# Altium project VFD_Clock.PrjPcb
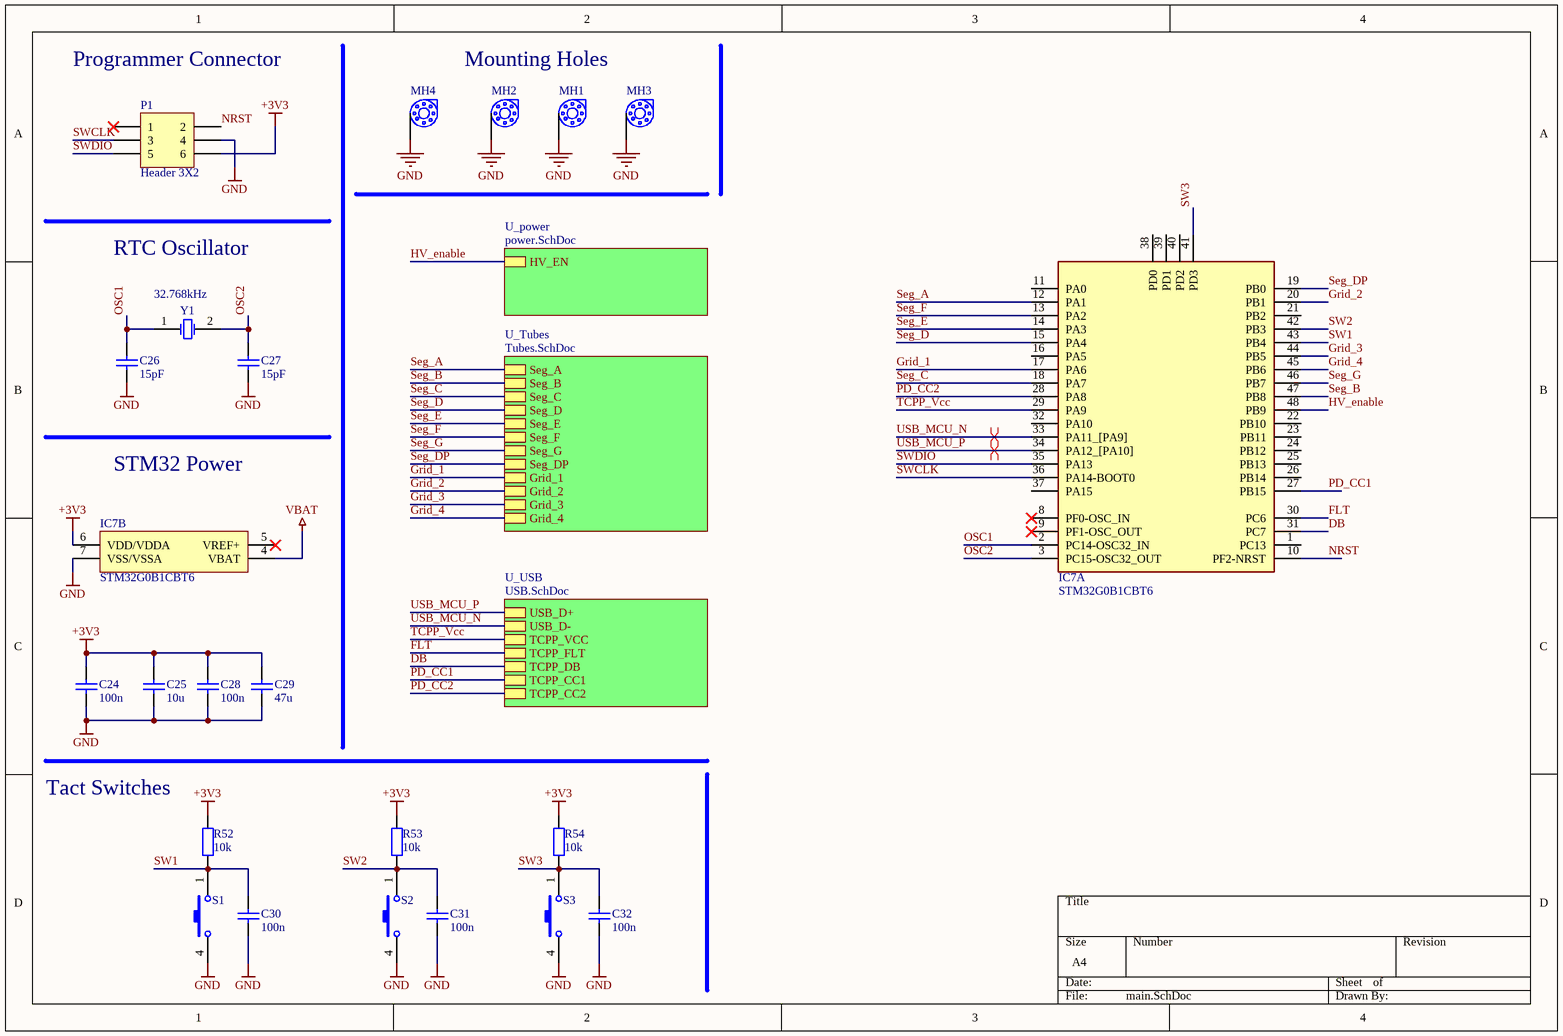
[diagram p0: main.SchDoc]
4 sheets, 138 parts. Net scope: hierarchical (ports join the sheet entries above them; power ports are global).
Board file: ClockPCB.PcbDoc
Sheets:
  main.SchDoc
    U_Tubes = Tubes.SchDoc
    U_power = power.SchDoc
    U_USB = USB.SchDoc

## Sheet main.SchDoc
size A4; SheetNumber: 1; SheetTotal: 4; SPICEModelCacheVDPEFNXI: <root> / <DocumentId>VDPEFNXI</DocumentId> / </root>

### Parts
C24  100n  [1608[0603]]
C25  10u  [1608[0603]]
C26  15pF  [1608[0603]]
C27  15pF  [1608[0603]]
C28  100n  [1608[0603]]
C29  47u  [1608[0603]]
C30  100n  [1608[0603]]
C31  100n  [1608[0603]]
C32  100n  [1608[0603]]
IC7  STM32G0B1CBT6  [QFP50P900X900X160-48N]  (parts A,B of 2)
MH1  HOLE 2mm  [Hole]  (value not drawn)  (no BOM)
MH2  HOLE 2mm  [Hole]  (value not drawn)  (no BOM)
MH3  HOLE 2mm  [Hole]  (value not drawn)  (no BOM)
MH4  HOLE 2mm  [Hole]  (value not drawn)  (no BOM)
P1  Header 3X2  [HDR2X3]
R52  10k  [J1-0603]
R53  10k  [J1-0603]
R54  10k  [J1-0603]
S1  PTS647SK70SMTR2N_LFS  [PTS647SK70SMTR2NLFS]  (value not drawn)
S2  PTS647SK70SMTR2N_LFS  [PTS647SK70SMTR2NLFS]  (value not drawn)
S3  PTS647SK70SMTR2N_LFS  [PTS647SK70SMTR2NLFS]  (value not drawn)
Y1  32.768kHz  [ABS06N32768kHzT]

### Sub-sheets
U_power = power.SchDoc: HV_EN
U_Tubes = Tubes.SchDoc: Seg_A, Seg_B, Seg_C, Seg_D, Seg_E, Seg_F, Seg_G, Seg_DP, Grid_1, Grid_2, Grid_3, Grid_4
U_USB = USB.SchDoc: TCPP_VCC, TCPP_FLT, TCPP_DB, TCPP_CC1, TCPP_CC2, USB_D+, USB_D-

### Nets
+3V3: C24.2 C25.2 C28.2 C29.2 IC7.6(VDD/VDDA) P1.6 R52.2 R53.2 R54.2
GND: C24.1 C25.1 C26.1 C27.1 C28.1 C29.1 C30.1 C31.1 C32.1 IC7.7(VSS/VSSA) MH1.0(GND) MH2.0(GND) MH3.0(GND) MH4.0(GND) P1.4 S1.4(COM_2) S2.4(COM_2) S3.4(COM_2)
VBAT: IC7.4(VBAT)
DB: IC7.31(PC7) ; sheet U_USB/TCPP_DB
FLT: IC7.30(PC6) ; sheet U_USB/TCPP_FLT
Grid_1: IC7.17(PA6) ; sheet U_Tubes/Grid_1
Grid_2: IC7.20(PB1) ; sheet U_Tubes/Grid_2
Grid_3: IC7.44(PB5) ; sheet U_Tubes/Grid_3
Grid_4: IC7.45(PB6) ; sheet U_Tubes/Grid_4
HV_enable: IC7.48(PB9) ; sheet U_power/HV_EN
NRST: IC7.10(PF2-NRST) P1.2
OSC1: C26.2 IC7.2(PC14-OSC32_IN) Y1.1
OSC2: C27.2 IC7.3(PC15-OSC32_OUT) Y1.2
PD_CC1: IC7.27(PB15) ; sheet U_USB/TCPP_CC1
PD_CC2: IC7.28(PA8) ; sheet U_USB/TCPP_CC2
Seg_A: IC7.12(PA1) ; sheet U_Tubes/Seg_A
Seg_B: IC7.47(PB8) ; sheet U_Tubes/Seg_B
Seg_C: IC7.18(PA7) ; sheet U_Tubes/Seg_C
Seg_D: IC7.15(PA4) ; sheet U_Tubes/Seg_D
Seg_DP: IC7.19(PB0) ; sheet U_Tubes/Seg_DP
Seg_E: IC7.14(PA3) ; sheet U_Tubes/Seg_E
Seg_F: IC7.13(PA2) ; sheet U_Tubes/Seg_F
Seg_G: IC7.46(PB7) ; sheet U_Tubes/Seg_G
SW1: C30.2 IC7.43(PB4) R52.1 S1.1(NO_1)
SW2: C31.2 IC7.42(PB3) R53.1 S2.1(NO_1)
SW3: C32.2 IC7.41(PD3) R54.1 S3.1(NO_1)
SWCLK: IC7.36(PA14-BOOT0) P1.3
SWDIO: IC7.35(PA13) P1.5
TCPP_Vcc: IC7.29(PA9) ; sheet U_USB/TCPP_VCC
USB_MCU_N: IC7.33(PA11_[PA9]) ; sheet U_USB/USB_D-
USB_MCU_P: IC7.34(PA12_[PA10]) ; sheet U_USB/USB_D+

Not connected (* = marked no-connect by the designer): IC7 1(PC13) 5(VREF+)* 8(PF0-OSC_IN)* 9(PF1-OSC_OUT)* 11(PA0) 16(PA5) 21(PB2) 22(PB10) 23(PB11) 24(PB12) 25(PB13) 26(PB14) 32(PA10) 37(PA15) 38(PD0) 39(PD1) 40(PD2); P1 1*

### Layout directives
differential pair: USB_MCU_N, USB_MCU_P

### Notes on the sheet
- Programmer Connector
- Mounting Holes
- RTC Oscillator
- STM32 Power
- (near R52) Tact Switches

### Library data of the parts
C24-C32 = Cap: Capacitor; Value: 100pF; Published: 8-Jun-2000; LatestRevisionDate: 17-Jul-2002; LatestRevisionNote: Re-released for DXP Platform.; PackageReference: RAD-0.3; Publisher: Altium Limited; PackageDescription: Radial Cap, Thru-Hole; 2 Leads; 0.3 in Pin Spacing
IC7 = STM32G0B1CBT6: Integrated Circuit; Manufacturer_Name: STMicroelectronics; Datasheet Link: https://www.st.com/resource/en/datasheet/stm32g0b1cb.pdf; Height: 1.6mm; Manufacturer_Part_Number: STM32G0B1CBT6; Mouser Part Number: 511-STM32G0B1CBT6; Mouser Price/Stock: https://www.mouser.co.uk/ProductDetail/STMicroelectronics/STM32G0B1CBT6?qs=CiayqK2gdcKaQJ%2FcS3grXw%3D%3D; Arrow Part Number: STM32G0B1CBT6; Arrow Price/Stock: https://www.arrow.com/en/products/stm32g0b1cbt6/stmicroelectronics?utm_currency=USD&region=nac
MH1-MH4 = MOUNT_HOLE_2MM_CORNER
P1 = Header 3X2: Header, 3-Pin, Dual row; LatestRevisionDate: 17-Jul-2002; LatestRevisionNote: Re-released for DXP Platform.; Publisher: Altium Limited
R52-R54 = Res2: Resistor; Value: 1K; Published: 8-Jun-2000; LatestRevisionDate: 17-Jul-2002; LatestRevisionNote: Re-released for DXP Platform.; PackageReference: AXIAL-0.4; Publisher: Altium Limited; PackageDescription: Axial Device, Thru-Hole; 2 Leads; 0.4 in Pin Spacing
S1-S3 = PTS647SK70SMTR2N_LFS: Switch (4-Pin Push); Manufacturer_Name: C & K COMPONENTS; Manufacturer_Part_Number: PTS647SK70SMTR2N LFS; Datasheet Link: https://www.ckswitches.com/media/2567/pts647.pdf; Height: 7mm
Y1 = ABS06N-32.768kHz-T: Crystal or Oscillator; Manufacturer_Name: ABRACON; Datasheet Link: https://abracon.com/datasheets/ABS06N.pdf; Height: 0.6mm; Manufacturer_Part_Number: ABS06N-32.768kHz-T

## Sheet Tubes.SchDoc
size A4; SheetNumber: 2; SheetTotal: 4
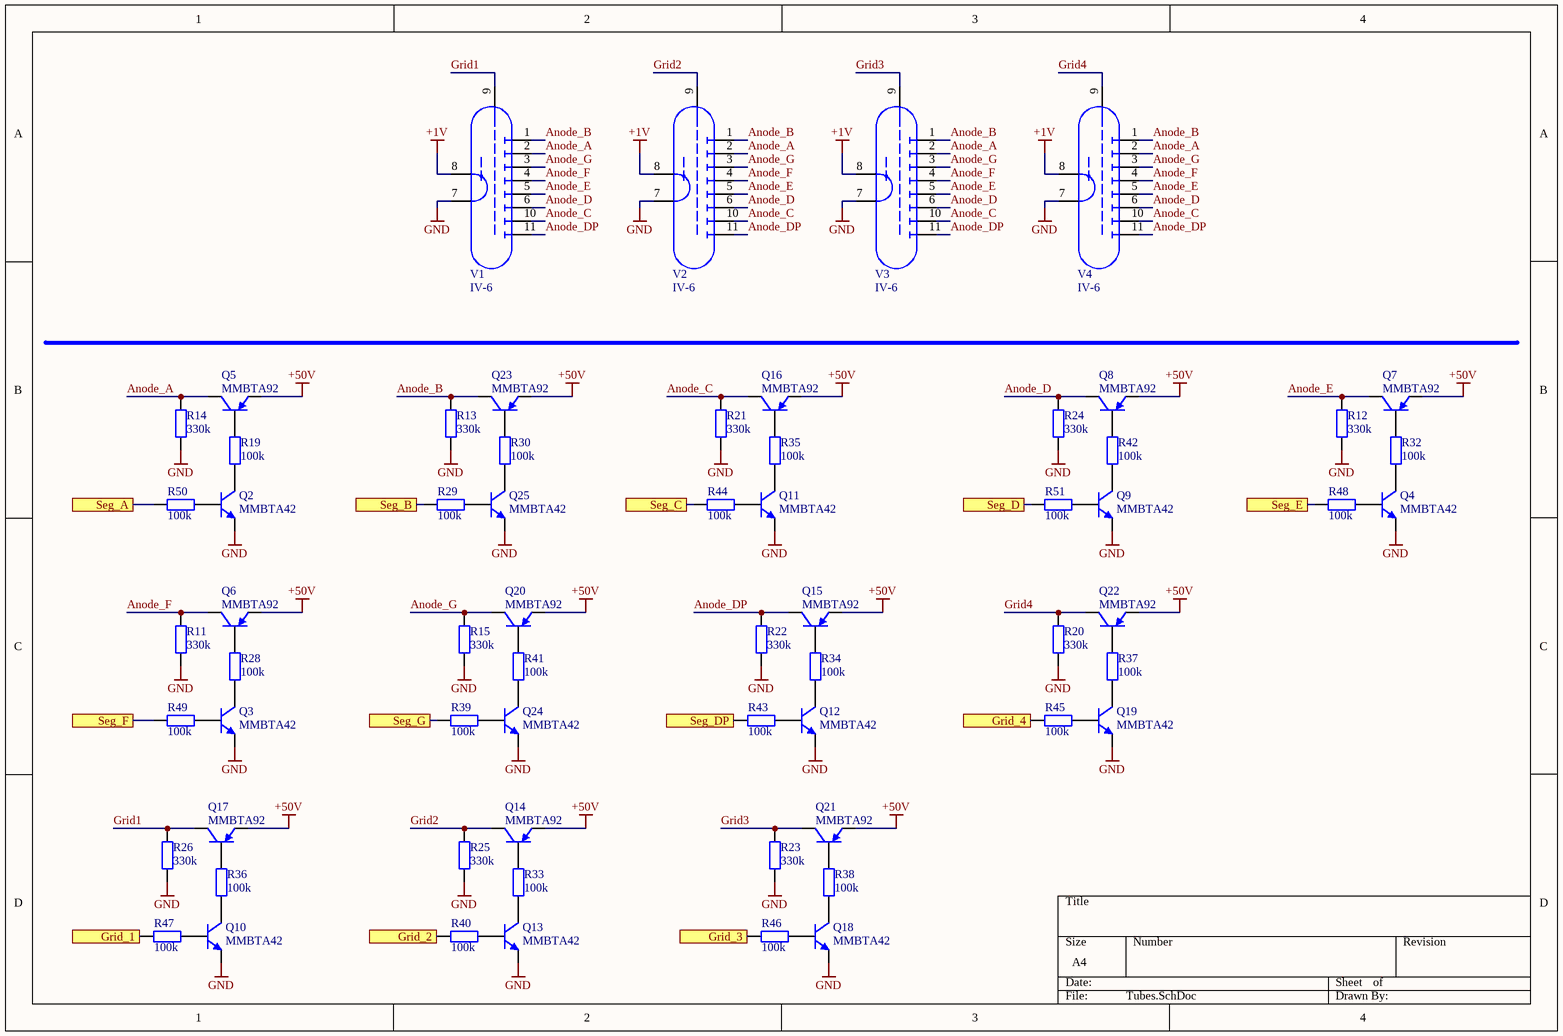
[diagram p1: Tubes.SchDoc]

### Parts
Q2  MMBTA42  [SOT-23_N]
Q3  MMBTA42  [SOT-23_N]
Q4  MMBTA42  [SOT-23_N]
Q5  MMBTA92  [SOT-23B_N]
Q6  MMBTA92  [SOT-23B_N]
Q7  MMBTA92  [SOT-23B_N]
Q8  MMBTA92  [SOT-23B_N]
Q9  MMBTA42  [SOT-23_N]
Q10  MMBTA42  [SOT-23_N]
Q11  MMBTA42  [SOT-23_N]
Q12  MMBTA42  [SOT-23_N]
Q13  MMBTA42  [SOT-23_N]
Q14  MMBTA92  [SOT-23B_N]
Q15  MMBTA92  [SOT-23B_N]
Q16  MMBTA92  [SOT-23B_N]
Q17  MMBTA92  [SOT-23B_N]
Q18  MMBTA42  [SOT-23_N]
Q19  MMBTA42  [SOT-23_N]
Q20  MMBTA92  [SOT-23B_N]
Q21  MMBTA92  [SOT-23B_N]
Q22  MMBTA92  [SOT-23B_N]
Q23  MMBTA92  [SOT-23B_N]
Q24  MMBTA42  [SOT-23_N]
Q25  MMBTA42  [SOT-23_N]
R11  330k  [RES 0805_2012]
R12  330k  [RES 0805_2012]
R13  330k  [RES 0805_2012]
R14  330k  [RES 0805_2012]
R15  330k  [RES 0805_2012]
R19  100k  [J1-0603]
R20  330k  [RES 0805_2012]
R21  330k  [RES 0805_2012]
R22  330k  [RES 0805_2012]
R23  330k  [RES 0805_2012]
R24  330k  [RES 0805_2012]
R25  330k  [RES 0805_2012]
R26  330k  [RES 0805_2012]
R28  100k  [J1-0603]
R29  100k  [J1-0603]
R30  100k  [J1-0603]
R32  100k  [J1-0603]
R33  100k  [J1-0603]
R34  100k  [J1-0603]
R35  100k  [J1-0603]
R36  100k  [J1-0603]
R37  100k  [J1-0603]
R38  100k  [J1-0603]
R39  100k  [J1-0603]
R40  100k  [J1-0603]
R41  100k  [J1-0603]
R42  100k  [J1-0603]
R43  100k  [J1-0603]
R44  100k  [J1-0603]
R45  100k  [J1-0603]
R46  100k  [J1-0603]
R47  100k  [J1-0603]
R48  100k  [J1-0603]
R49  100k  [J1-0603]
R50  100k  [J1-0603]
R51  100k  [J1-0603]
V1  IV-6  [IV-6]
V2  IV-6  [IV-6]
V3  IV-6  [IV-6]
V4  IV-6  [IV-6]

### Ports
Grid_1 (see main[2C]), Grid_2 (see main[2C]), Grid_3 (see main[2C]), Grid_4 (see main[2C]), Seg_A (see main[2B]), Seg_B (see main[2B]), Seg_C (see main[2B]), Seg_D (see main[2C]), Seg_DP (see main[2C]), Seg_E (see main[2C]), Seg_F (see main[2C]), Seg_G (see main[2C])

### Nets
+1V: V1.8 V2.8 V3.8 V4.8
+50V: Q5.3(E) Q6.3(E) Q7.3(E) Q8.3(E) Q14.3(E) Q15.3(E) Q16.3(E) Q17.3(E) Q20.3(E) Q21.3(E) Q22.3(E) Q23.3(E)
GND: Q2.3(E) Q3.3(E) Q4.3(E) Q9.3(E) Q10.3(E) Q11.3(E) Q12.3(E) Q13.3(E) Q18.3(E) Q19.3(E) Q24.3(E) Q25.3(E) R11.1 R12.1 R13.1 R14.1 R15.1 R20.1 R21.1 R22.1 R23.1 R24.1 R25.1 R26.1 V1.7 V2.7 V3.7 V4.7
Anode_A: Q5.1(C) R14.2 V1.2 V2.2 V3.2 V4.2
Anode_B: Q23.1(C) R13.2 V1.1 V2.1 V3.1 V4.1
Anode_C: Q16.1(C) R21.2 V1.10 V2.10 V3.10 V4.10
Anode_D: Q8.1(C) R24.2 V1.6 V2.6 V3.6 V4.6
Anode_DP: Q15.1(C) R22.2 V1.11 V2.11 V3.11 V4.11
Anode_E: Q7.1(C) R12.2 V1.5 V2.5 V3.5 V4.5
Anode_F: Q6.1(C) R11.2 V1.4 V2.4 V3.4 V4.4
Anode_G: Q20.1(C) R15.2 V1.3 V2.3 V3.3 V4.3
Grid1: Q17.1(C) R26.2 V1.9
Grid2: Q14.1(C) R25.2 V2.9
Grid3: Q21.1(C) R23.2 V3.9
Grid4: Q22.1(C) R20.2 V4.9
Grid_1: R47.1 ; port Grid_1
Grid_2: R40.1 ; port Grid_2
Grid_3: R46.1 ; port Grid_3
Grid_4: R45.1 ; port Grid_4
Seg_A: R50.1 ; port Seg_A
Seg_B: R29.1 ; port Seg_B
Seg_C: R44.1 ; port Seg_C
Seg_D: R51.1 ; port Seg_D
Seg_DP: R43.1 ; port Seg_DP
Seg_E: R48.1 ; port Seg_E
Seg_F: R49.1 ; port Seg_F
Seg_G: R39.1 ; port Seg_G
NetQ2_1: Q2.1(C) R19.1
NetQ2_2: Q2.2(B) R50.2
NetQ3_1: Q3.1(C) R28.1
NetQ3_2: Q3.2(B) R49.2
NetQ4_1: Q4.1(C) R32.1
NetQ4_2: Q4.2(B) R48.2
NetQ5_2: Q5.2(B) R19.2
NetQ6_2: Q6.2(B) R28.2
NetQ7_2: Q7.2(B) R32.2
NetQ8_2: Q8.2(B) R42.2
NetQ9_1: Q9.1(C) R42.1
NetQ9_2: Q9.2(B) R51.2
NetQ10_1: Q10.1(C) R36.1
NetQ10_2: Q10.2(B) R47.2
NetQ11_1: Q11.1(C) R35.1
NetQ11_2: Q11.2(B) R44.2
NetQ12_1: Q12.1(C) R34.1
NetQ12_2: Q12.2(B) R43.2
NetQ13_1: Q13.1(C) R33.1
NetQ13_2: Q13.2(B) R40.2
NetQ14_2: Q14.2(B) R33.2
NetQ15_2: Q15.2(B) R34.2
NetQ16_2: Q16.2(B) R35.2
NetQ17_2: Q17.2(B) R36.2
NetQ18_1: Q18.1(C) R38.1
NetQ18_2: Q18.2(B) R46.2
NetQ19_1: Q19.1(C) R37.1
NetQ19_2: Q19.2(B) R45.2
NetQ20_2: Q20.2(B) R41.2
NetQ21_2: Q21.2(B) R38.2
NetQ22_2: Q22.2(B) R37.2
NetQ23_2: Q23.2(B) R30.2
NetQ24_1: Q24.1(C) R41.1
NetQ24_2: Q24.2(B) R39.2
NetQ25_1: Q25.1(C) R30.1
NetQ25_2: Q25.2(B) R29.2

### Library data of the parts
Q2-Q4 Q9-Q13 Q18 Q19 Q24 Q25 = NPN: NPN Bipolar Transistor; Published: 8-Jun-2000; LatestRevisionDate: 17-Jul-2002; LatestRevisionNote: Re-released for DXP Platform.; PackageReference: TO-226-AA; Publisher: Altium Limited; PackageDescription: TO, Flat Index; 3 In-Line, Axial Leads; Body Dia. 4.8mm; Leads 0.55 x 0.51 mm (max); Code_JEDEC: TO-226-AA
Q5-Q8 Q14-Q17 Q20-Q23 = PNP: PNP Bipolar Transistor; Published: 8-Jun-2000; LatestRevisionDate: 29-May-2009; LatestRevisionNote: IPC-7351 Footprint Added.; PackageVersion: Aug-1999; PackageReference: SOT-23B; Publisher: Altium Limited; PackageDescription: 3-Pin SOT-23 Package 0.95 mm Pitch, 2.4 mm Lead Span
R11-R15 R19-R26 R28-R30 R32-R51 = Res2: Resistor; Value: 1K; Published: 8-Jun-2000; LatestRevisionDate: 17-Jul-2002; LatestRevisionNote: Re-released for DXP Platform.; PackageReference: AXIAL-0.4; Publisher: Altium Limited; PackageDescription: Axial Device, Thru-Hole; 2 Leads; 0.4 in Pin Spacing

## Sheet power.SchDoc
size A4; SheetNumber: 3; SheetTotal: 4; SPICEModelCacheCMTQJRSB: <root> / <DocumentId>CMTQJRSB</DocumentId> / </root>
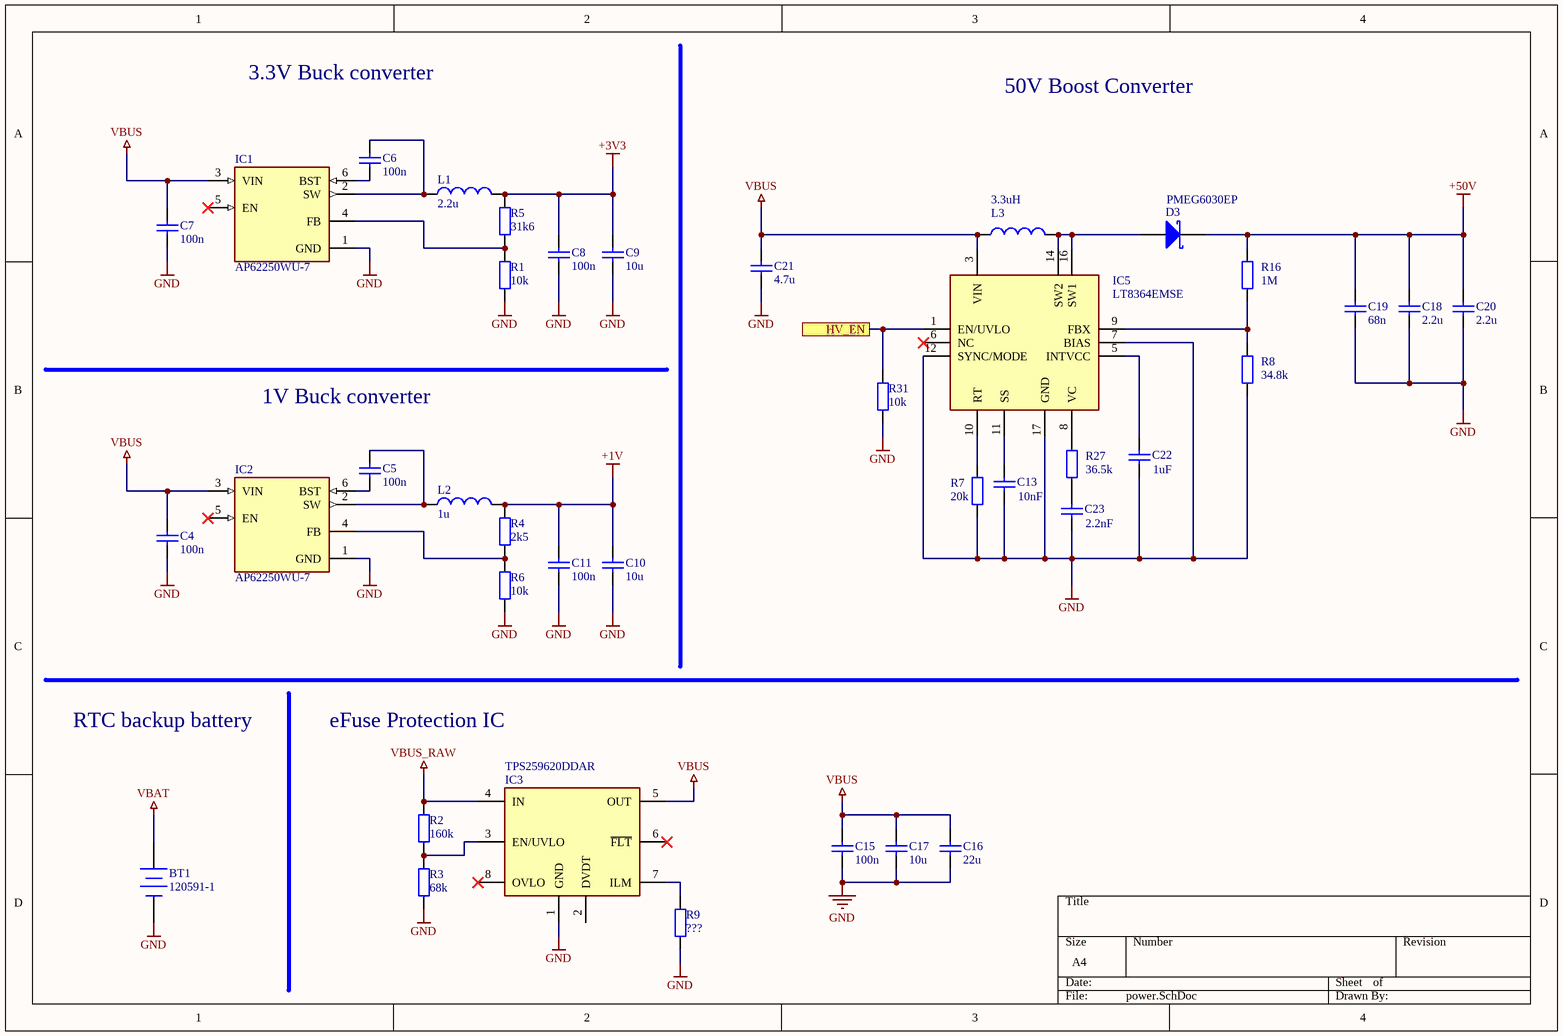
[diagram p2: power.SchDoc]

### Parts
BT1  120591-1  [BR1220_Horizontal]
C4  100n  [1608[0603]]
C5  100n  [1608[0603]]
C6  100n  [1608[0603]]
C7  100n  [1608[0603]]
C8  100n  [1608[0603]]
C9  10u  [1608[0603]]
C10  10u  [1608[0603]]
C11  100n  [1608[0603]]
C13  10nF  [1608[0603]]
C15  100n  [1608[0603]]
C16  22u  [1608[0603]]
C17  10u  [1608[0603]]
C18  2.2u  [C1210]
C19  68n  [1608[0603]]
C20  2.2u  [C1210]
C21  4.7u  [1608[0603]]
C22  1uF  [1608[0603]]
C23  2.2nF  [1608[0603]]
D3  PMEG6030EP  [PMEG6030EP115]
IC1  AP62250WU-7  [TSOT26]
IC2  AP62250WU-7  [TSOT26]
IC3  TPS259620DDAR  [SOIC127P600X170-9N]
IC5  LT8364EMSE  [LT8364EMSEPBF]
L1  2.2u  [BWVS004040182R2M00]
L2  1u  [BWVS004040182R2M00]
L3  3.3uH  [BWVS004040182R2M00]
R1  10k  [J1-0603]
R2  160k  [J1-0603]
R3  68k  [J1-0603]
R4  2k5  [J1-0603]
R5  31k6  [J1-0603]
R6  10k  [J1-0603]
R7  20k  [J1-0603]
R8  34.8k  [J1-0603]
R9  ???  [J1-0603]
R16  1M  [J1-0603]
R27  36.5k  [J1-0603]
R31  10k  [J1-0603]

### Ports
HV_EN (see main[2B])

### Nets
+1V: C10.2 C11.2 L2.2 R4.2
+3V3: C8.2 C9.2 L1.2 R5.2
+50V: C18.2 C19.2 C20.2 D3.2(K) R16.2
GND: BT1.1 C4.1 C7.1 C8.1 C9.1 C10.1 C11.1 C13.1 C15.1 C16.1 C17.1 C18.1 C19.1 C20.1 C21.1 C22.1 C23.1 IC1.1(GND) IC2.1(GND) IC3.1(GND) IC5.7(BIAS) IC5.12(SYNC/MODE) IC5.17(GND) R1.1 R3.1 R6.1 R7.1 R8.1 R9.1 R31.1
VBAT: BT1.2
VBUS: C4.2 C7.2 C15.2 C16.2 C17.2 C21.2 IC1.3(VIN) IC2.3(VIN) IC3.5(OUT) IC5.3(VIN) L3.1
VBUS_RAW: IC3.4(IN) R2.2
HV_enable: IC5.1(EN/UVLO) R31.2 ; port HV_EN
NetC5_1: C5.1 IC2.6(BST)
NetC5_2: C5.2 IC2.2(SW) L2.1
NetC6_1: C6.1 IC1.6(BST)
NetC6_2: C6.2 IC1.2(SW) L1.1
NetC13_2: C13.2 IC5.11(SS)
NetC22_2: C22.2 IC5.5(INTVCC)
NetC23_2: C23.2 R27.1
NetD3_1: D3.1(A) IC5.14(SW2) IC5.16(SW1) L3.2
NetIC1_4: IC1.4(FB) R1.2 R5.1
NetIC2_4: IC2.4(FB) R4.1 R6.2
NetIC3_3: IC3.3(EN/UVLO) R2.1 R3.2
NetIC3_7: IC3.7(ILM) R9.2
NetIC5_8: IC5.8(VC) R27.2
NetIC5_9: IC5.9(FBX) R8.2 R16.1
NetIC5_10: IC5.10(RT) R7.2

Not connected (* = marked no-connect by the designer): IC1 5(EN)*; IC2 5(EN)*; IC3 2(DVDT) 6(~{FLT})* 8(OVLO)*; IC5 6(NC)*

### Notes on the sheet
- 3.3V Buck converter
- 50V Boost Converter
- 1V Buck converter
- RTC backup battery
- eFuse Protection IC

### Library data of the parts
BT1 = 120591-1: Battery; Manufacturer_Name: TE Connectivity; Datasheet Link: http://www.te.com/commerce/DocumentDelivery/DDEController?Action=srchrtrv&DocNm=120591&DocType=Customer+Drawing&DocLang=English&DocFormat=pdf&PartCntxt=120591-1; Manufacturer_Part_Number: 120591-1; Mouser Part Number: 571-1205911; Mouser Price/Stock: https://www.mouser.co.uk/ProductDetail/TE-Connectivity/120591-1?qs=cB%252BprIo57OeZ1n1mnEiYEw%3D%3D; Arrow Part Number: 120591-1; Arrow Price/Stock: https://www.arrow.com/en/products/120591-1/te-connectivity?utm_currency=USD&region=nac
C4-C11 C13 C15-C23 = Cap: Capacitor; Value: 100pF; Published: 8-Jun-2000; LatestRevisionDate: 17-Jul-2002; LatestRevisionNote: Re-released for DXP Platform.; PackageReference: RAD-0.3; Publisher: Altium Limited; PackageDescription: Radial Cap, Thru-Hole; 2 Leads; 0.3 in Pin Spacing
D3 = PMEG6030EP: Schottky Diode; Published: 8-Jun-2000; LatestRevisionDate: 17-Jul-2002; LatestRevisionNote: Re-released for DXP Platform.; PackageReference: SMB; Publisher: Altium Limited; PackageDescription: DO-214-AA/SMB; 2 C-Bend Leads; Body 5.3 x 3.6 mm, inc. leads (LxW); Code_JEDEC: DO-214-AA
IC1 IC2 = AP62250WU-7: Integrated Circuit; Manufacturer_Name: Diodes Incorporated; Datasheet Link: https://www.diodes.com//assets/Datasheets/AP62250.pdf; Height: 1mm; Manufacturer_Part_Number: AP62250WU-7; Mouser Part Number: 621-AP62250WU-7; Mouser Price/Stock: https://www.mouser.co.uk/ProductDetail/Diodes-Incorporated/AP62250WU-7?qs=7MVldsJ5Uax1PUc8sdeimQ%3D%3D; Arrow Part Number: AP62250WU-7; Arrow Price/Stock: https://www.arrow.com/en/products/ap62250wu-7/diodes-incorporated?region=europe
IC3 = TPS259620DDAR: Integrated Circuit; Manufacturer_Name: Texas Instruments; Datasheet Link: https://www.ti.com/lit/gpn/TPS2596; Height: 1.7mm; Manufacturer_Part_Number: TPS259620DDAR; Mouser Part Number: 595-TPS259620DDAR; Mouser Price/Stock: https://www.mouser.co.uk/ProductDetail/Texas-Instruments/TPS259620DDAR?qs=XeJtXLiO41RogCpRV1l%252BSg%3D%3D; Arrow Part Number: TPS259620DDAR; Arrow Price/Stock: https://www.arrow.com/en/products/tps259620ddar/texas-instruments
IC5 = LT8364EMSE#PBF: Integrated Circuit; Manufacturer_Name: Analog Devices; Datasheet Link: https://www.analog.com/media/en/technical-documentation/data-sheets/lt8364.pdf; Height: 1.1mm; Manufacturer_Part_Number: LT8364EMSE#PBF; Mouser Part Number: 584-LT8364EMSEPBF; Mouser Price/Stock: https://www.mouser.co.uk/ProductDetail/Analog-Devices/LT8364EMSEPBF?qs=W0yvOO0ixfH269lPR9cWrw%3D%3D; Arrow Part Number: LT8364EMSE#PBF; Arrow Price/Stock: https://www.arrow.com/en/products/lt8364emsepbf/analog-devices?region=nac
L1 L2 = Inductor: Code_IEC: 1005; Value: 10mH; Published: 8-Jun-2000; LatestRevisionDate: 29-May-2009; LatestRevisionNote: IPC-7351 Footprint Added.; PackageReference: 0402-A; Publisher: Altium Limited; PackageDescription: Chip Inductor; Code_JEITA: 0402
L3 = Inductor: Code_IEC: 1005; Published: 8-Jun-2000; LatestRevisionDate: 29-May-2009; LatestRevisionNote: IPC-7351 Footprint Added.; PackageReference: 0402-A; Publisher: Altium Limited; PackageDescription: Chip Inductor; Code_JEITA: 0402; Value: 3.3uH
R1-R9 R16 R27 R31 = Res2: Resistor; Value: 1K; Published: 8-Jun-2000; LatestRevisionDate: 17-Jul-2002; LatestRevisionNote: Re-released for DXP Platform.; PackageReference: AXIAL-0.4; Publisher: Altium Limited; PackageDescription: Axial Device, Thru-Hole; 2 Leads; 0.4 in Pin Spacing

## Sheet USB.SchDoc
size A4; SheetNumber: 4; SheetTotal: 4
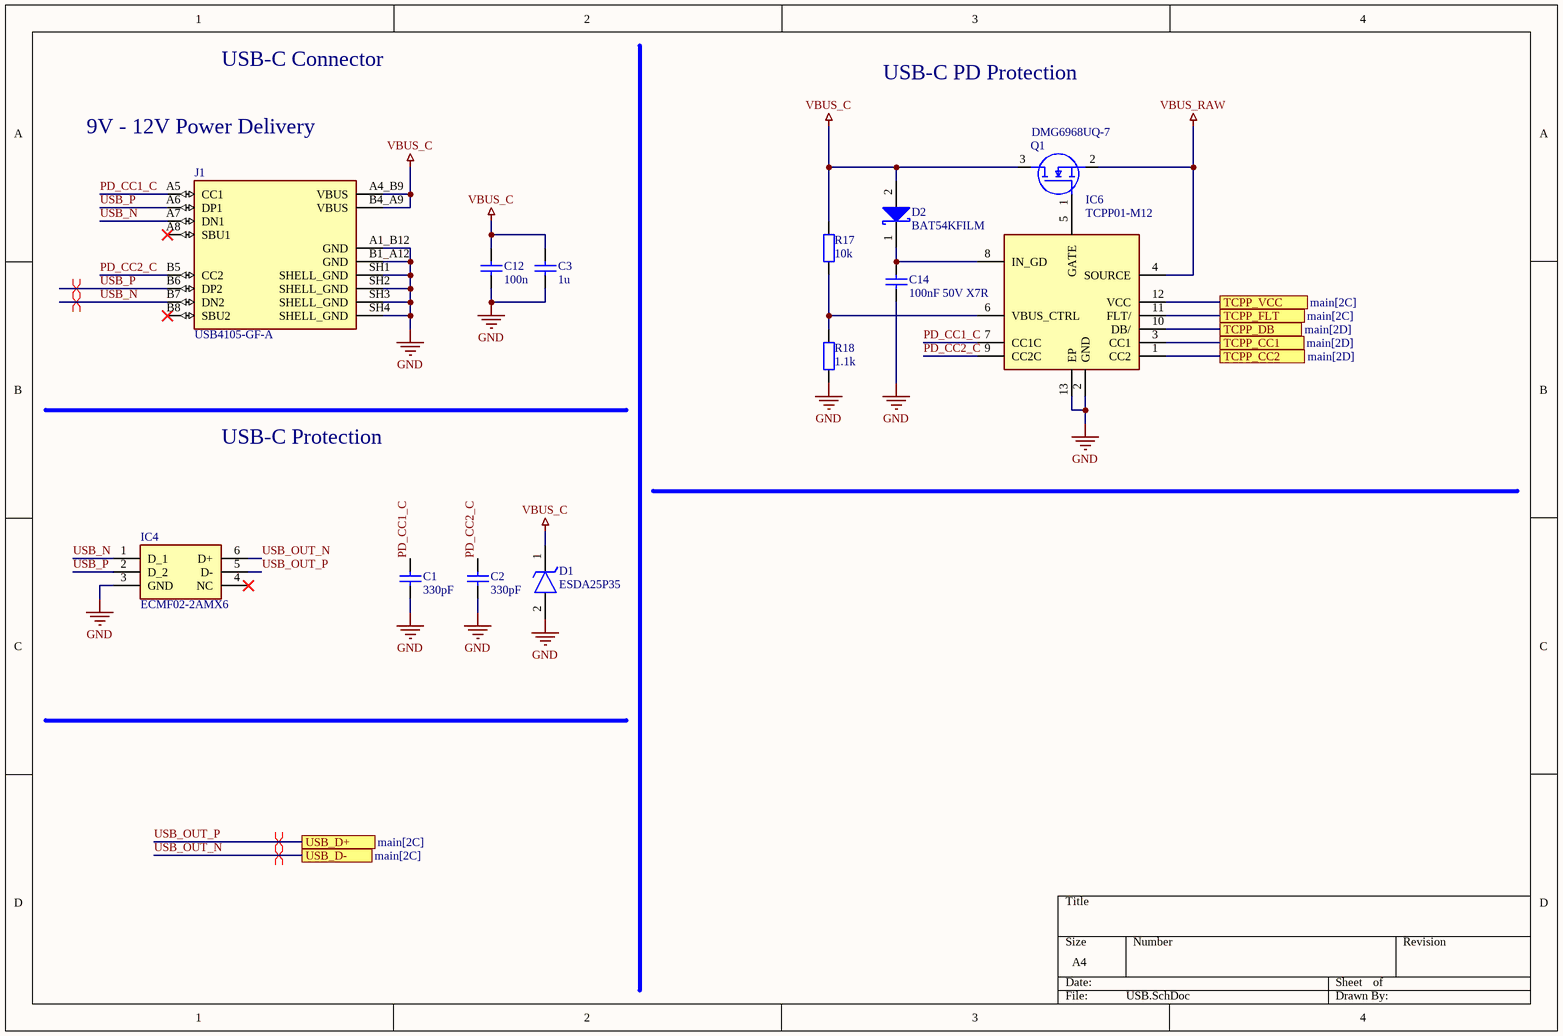
[diagram p3: USB.SchDoc]

### Parts
C1  330pF  [1608[0603]]
C2  330pF  [1608[0603]]
C3  1u  [1608[0603]]
C12  100n  [1608[0603]]
C14  100nF 50V X7R  [1608[0603]]
D1  ESDA25P35  [ESDA25P351U1M]
D2  BAT54KFILM  [SODFL1608X70N]
IC4  ECMF02-2AMX6  [SON50P150X170X55-6N-D]
IC6  TCPP01-M12  [QFN50P300X300X100-13N-D]
J1  USB4105-GF-A  [GCT_USB4105-GF-A]
Q1  DMG6968UQ-7  [SOT96P240X110-3N]
R17  10k  [J1-0603]
R18  1.1k  [J1-0603]

### Ports
TCPP_CC1 (see main[2D]), TCPP_CC2 (see main[2D]), TCPP_DB (see main[2D]), TCPP_FLT (see main[2C]), TCPP_VCC (see main[2C]), USB_D+ (see main[2C]), USB_D- (see main[2C])

### Nets
GND: C1.1 C2.1 C3.1 C12.1 C14.1 D1.2(A) IC4.3(GND) IC6.2(GND) IC6.13(EP) J1.A1_B12(GND) J1.B1_A12(GND) J1.SH1(SHELL_GND) J1.SH2(SHELL_GND) J1.SH3(SHELL_GND) J1.SH4(SHELL_GND) R18.1
VBUS_C: C3.2 C12.2 D1.1(K) D2.2(A) J1.A4_B9(VBUS) J1.B4_A9(VBUS) Q1.3(D) R17.2
VBUS_RAW: IC6.4(SOURCE) Q1.2(S)
DB: IC6.10(DB/) ; port TCPP_DB
FLT: IC6.11(FLT/) ; port TCPP_FLT
PD_CC1: IC6.3(CC1) ; port TCPP_CC1
PD_CC1_C: C1.2 IC6.7(CC1C) J1.A5(CC1)
PD_CC2: IC6.1(CC2) ; port TCPP_CC2
PD_CC2_C: C2.2 IC6.9(CC2C) J1.B5(CC2)
TCPP_Vcc: IC6.12(VCC) ; port TCPP_VCC
USB_N: IC4.1(D_1) J1.A7(DN1) J1.B7(DN2)
USB_OUT_N: IC4.6(D+) ; port USB_D-  [project net USB_MCU_N]
USB_OUT_P: IC4.5(D-) ; port USB_D+  [project net USB_MCU_P]
USB_P: IC4.2(D_2) J1.A6(DP1) J1.B6(DP2)
NetC14_2: C14.2 D2.1(K) IC6.8(IN_GD)
NetIC6_5: IC6.5(GATE) Q1.1(G)
NetIC6_6: IC6.6(VBUS_CTRL) R17.1 R18.2

Not connected (* = marked no-connect by the designer): IC4 4(NC)*; J1 A8(SBU1)* B8(SBU2)*

### Layout directives
differential pair; net class USB: USB_N, USB_P
differential pair: USB_MCU_N, USB_MCU_P

### Notes on the sheet
- USB-C Connector
- USB-C PD Protection
- 9V - 12V Power Delivery
- USB-C Protection

### Library data of the parts
C1 C2 = Cap: Capacitor; Published: 8-Jun-2000; LatestRevisionDate: 17-Jul-2002; LatestRevisionNote: Re-released for DXP Platform.; PackageReference: RAD-0.3; Publisher: Altium Limited; PackageDescription: Radial Cap, Thru-Hole; 2 Leads; 0.3 in Pin Spacing; Value: 330pF
C3 C12 = Cap: Capacitor; Value: 100pF; Published: 8-Jun-2000; LatestRevisionDate: 17-Jul-2002; LatestRevisionNote: Re-released for DXP Platform.; PackageReference: RAD-0.3; Publisher: Altium Limited; PackageDescription: Radial Cap, Thru-Hole; 2 Leads; 0.3 in Pin Spacing
C14 = Cap: 50 V X7R 100 nF capacitor; Published: 8-Jun-2000; LatestRevisionDate: 17-Jul-2002; LatestRevisionNote: Re-released for DXP Platform.; PackageReference: RAD-0.3; Publisher: Altium Limited; PackageDescription: Radial Cap, Thru-Hole; 2 Leads; 0.3 in Pin Spacing; Value: 100nF
D1 = ESDA25P35-1U1M: TVS Diode (Uni-directional); Manufacturer_Name: STMicroelectronics; Datasheet Link: https://www.st.com/resource/en/datasheet/esda25p35-1u1m.pdf; Height: 0.6mm; Manufacturer_Part_Number: ESDA25P35-1U1M; Mouser Part Number: 511-ESDA25P35-1U1M; Mouser Price/Stock: https://www.mouser.co.uk/ProductDetail/STMicroelectronics/ESDA25P35-1U1M?qs=aVyJF2WnouQUWqgNP85ZrA%3D%3D; Arrow Part Number: ESDA25P35-1U1M; Arrow Price/Stock: https://www.arrow.com/en/products/esda25p35-1u1m/stmicroelectronics?utm_currency=USD&region=europe
D2 = BAT54KFILM: Diode; Manufacturer_Name: STMicroelectronics; Datasheet Link: http://www.st.com/web/en/resource/technical/document/datasheet/CD00001322.pdf; Height: 0.7mm; Manufacturer_Part_Number: BAT54KFILM; Mouser Part Number: 511-BAT54KFILM; Mouser Price/Stock: https://www.mouser.co.uk/ProductDetail/STMicroelectronics/BAT54KFILM?qs=jZi1jxfVU95Y9ce6l3OT%252BA%3D%3D; Arrow Part Number: BAT54KFILM; Arrow Price/Stock: https://www.arrow.com/en/products/bat54kfilm/stmicroelectronics?region=europe
IC4 = ECMF02-2AMX6: Integrated Circuit; Manufacturer_Name: STMicroelectronics; Datasheet Link: http://www.st.com/content/ccc/resource/technical/document/datasheet/3a/28/cf/d0/31/63/48/8c/CD00282307.pdf/files/CD00282307.pdf/jcr:content/translations/en.CD00282307.pdf; Height: 0.55mm; Manufacturer_Part_Number: ECMF02-2AMX6; Mouser Part Number: 511-ECMF02-2AMX6; Mouser Price/Stock: https://www.mouser.co.uk/ProductDetail/STMicroelectronics/ECMF02-2AMX6?qs=raAh8RbVwI65u5gmT42%2Flg%3D%3D; Arrow Part Number: ECMF02-2AMX6; Arrow Price/Stock: https://www.arrow.com/en/products/ecmf02-2amx6/stmicroelectronics?utm_currency=USD&region=europe
IC6 = TCPP01-M12: Integrated Circuit; Manufacturer_Name: STMicroelectronics; Datasheet Link: https://www.st.com/resource/en/datasheet/tcpp01-m12.pdf; Height: 1mm; Manufacturer_Part_Number: TCPP01-M12; Mouser Part Number: 511-TCPP01-M12; Mouser Price/Stock: https://www.mouser.co.uk/ProductDetail/STMicroelectronics/TCPP01-M12?qs=%252B6g0mu59x7KCafIwapwG2A%3D%3D; Arrow Part Number: TCPP01-M12; Arrow Price/Stock: https://www.arrow.com/en/products/tcpp01-m12/stmicroelectronics?utm_currency=USD&region=nac
J1 = USB4105-GF-A: MF: {'manufacturer': u'GCT'}; Package: None; Price: None; Value: *; MP: USB4105-GF-A; Availability: Unavailable
Q1 = DMG6968UQ-7: MOSFET (N-Channel); Manufacturer_Name: Diodes Incorporated; Datasheet Link: https://www.diodes.com//assets/Datasheets/products_inactive_data/DMG6968UQ.pdf; Height: 1.1mm; Manufacturer_Part_Number: DMG6968UQ-7; Mouser Part Number: 621-DMG6968UQ-7; Mouser Price/Stock: https://www.mouser.co.uk/ProductDetail/Diodes-Incorporated/DMG6968UQ-7?qs=MNIFWdyJgboErGB0%2FFpP4Q%3D%3D; Arrow Part Number: DMG6968UQ-7; Arrow Price/Stock: https://www.arrow.com/en/products/dmg6968uq-7/diodes-incorporated?region=asia
R17 R18 = Res2: Resistor; Value: 1K; Published: 8-Jun-2000; LatestRevisionDate: 17-Jul-2002; LatestRevisionNote: Re-released for DXP Platform.; PackageReference: AXIAL-0.4; Publisher: Altium Limited; PackageDescription: Axial Device, Thru-Hole; 2 Leads; 0.4 in Pin Spacing

## Nets that join several sheets
+1V: Tubes (V1.8 V2.8 V3.8 V4.8), power (C10.2 C11.2 L2.2 R4.2)
+3V3: main (9 pins), power (C8.2 C9.2 L1.2 R5.2)
+50V: Tubes (12 pins), power (5 pins)
GND: main (18 pins), Tubes (28 pins), power (30 pins), USB (16 pins)
VBAT: main (IC7.4), power (BT1.2)
VBUS_RAW: power (IC3.4 R2.2), USB (IC6.4 Q1.2)
DB: main (IC7.31), USB (IC6.10)
FLT: main (IC7.30), USB (IC6.11)
Grid_1: main (IC7.17), Tubes (R47.1)
Grid_2: main (IC7.20), Tubes (R40.1)
Grid_3: main (IC7.44), Tubes (R46.1)
Grid_4: main (IC7.45), Tubes (R45.1)
HV_enable: main (IC7.48), power (IC5.1 R31.2)
PD_CC1: main (IC7.27), USB (IC6.3)
PD_CC2: main (IC7.28), USB (IC6.1)
Seg_A: main (IC7.12), Tubes (R50.1)
Seg_B: main (IC7.47), Tubes (R29.1)
Seg_C: main (IC7.18), Tubes (R44.1)
Seg_D: main (IC7.15), Tubes (R51.1)
Seg_DP: main (IC7.19), Tubes (R43.1)
Seg_E: main (IC7.14), Tubes (R48.1)
Seg_F: main (IC7.13), Tubes (R49.1)
Seg_G: main (IC7.46), Tubes (R39.1)
TCPP_Vcc: main (IC7.29), USB (IC6.12)
USB_MCU_N: main (IC7.33), USB (IC4.6)
USB_MCU_P: main (IC7.34), USB (IC4.5)